# EAGLE design OPR5925Breakout (EAGLE 9.6.2)
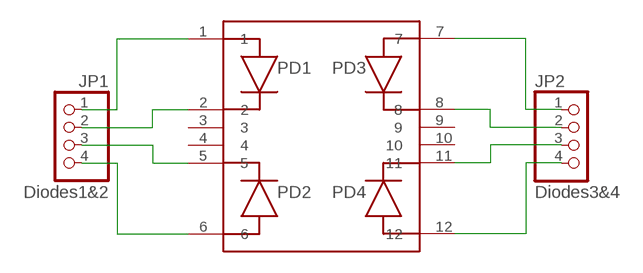
[diagram p0: schematic, sheet 1]

## Parts
JP1  Diodes1&2  PINHD-1X4  [1X04]
JP2  Diodes3&4  PINHD-1X4  [1X04]
U$1  OPR5925  [OPR5925]

## Nets
N$1: JP1.4 U$1.6
N$2: JP1.3 U$1.5
N$3: JP1.2 U$1.2
N$4: JP1.1 U$1.1
N$5: JP2.1 U$1.7
N$6: JP2.2 U$1.8
N$7: JP2.3 U$1.11
N$8: JP2.4 U$1.12
Unconnected: U$1.3 U$1.4 U$1.9 U$1.10

## Library data of the parts
JP1 JP2 = pinhead:PINHD-1X4: PIN HEADER
U$1 = OPR5925:OPR5925

## Board
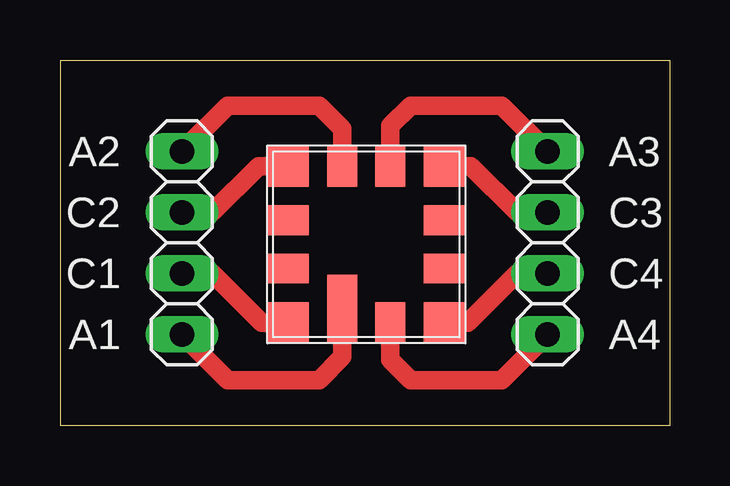
[diagram p1: board, top side]

Size 25.4 x 15.24 mm. Coordinates in mm from the lower left corner, seen from the top.
Outline: 0,15.24 0,0 25.4,0 25.4,15.24 0,15.24
Copper layers (1*16): Top 0.035mm / dielectric 1.5mm / Bottom 0.035mm
Design rules "default *": minimum track width 6mil, minimum drill 0.35mm, track to track 6mil, track to pad 6mil, pad to pad 6mil, via to via 6mil, smd to smd 6mil, copper to edge 40mil, drill to drill 6mil, minimum pad ring 10mil, minimum via ring 8mil, stop-mask expansion 4mil, vias tented up to drill 0mil, thermal gap 5mil

### Footprints (pad centres in the part's own frame; a part is rotated, then mirrored left to right if it is on the bottom)
1X04 = drill 1.016 long: 1 -3.81,0; 2 -1.27,0; 3 1.27,0; 4 3.81,0
OPR5925 = smd 2.87 x 1.245: 1 6.566,2.87 | smd 1.727 x 1.727: 2 7.137,0.61; 5 0.61,0.61; 8 0.61,7.137; 11 7.137,7.137 | smd 1.245 x 1.727: 3 4.877,0.61; 4 2.87,0.61; 9 2.87,7.137; 10 4.877,7.137 | smd 1.727 x 1.245: 6 0.61,2.87; 7 0.61,4.877; 12 7.137,4.877

### Placement (x,y rotation side)
JP1  5.08,7.62 90 top
JP2  20.32,7.62 270 top
U$1  8.89,11.43 270 top

### Tracks (layer width: path | path; a pad name or v marks a point on that pad's centre or on a via)
N$1
  Top 0.762: JP1.4 6.99,13.34 10.79,13.34 11.76,12.37 U$1.6
N$2
  Top 0.762: JP1.3 6.35,8.89 8.28,10.82 U$1.5
N$3
  Top 0.762: JP1.2 6.35,6.35 8.41,4.29 U$1.2
N$4
  Top 0.762: JP1.1 6.99,1.91 10.79,1.91 11.76,2.87 U$1.1
N$5
  Top 0.762: JP2.1 18.41,13.34 14.61,13.34 13.77,12.5 U$1.7
N$6
  Top 0.762: JP2.2 19.05,8.89 17.12,10.82 U$1.8
N$7
  Top 0.762: JP2.3 19.05,6.35 16.99,4.29 U$1.11
N$8
  Top 0.762: JP2.4 18.41,1.91 14.61,1.91 13.77,2.74 U$1.12

### Text on the board
tNames: A2 | A3 | C2 | C3 | C1 | C4 | A1 | A4
bNames: OPR5925 Breakout / Richard McManus / April, 2023